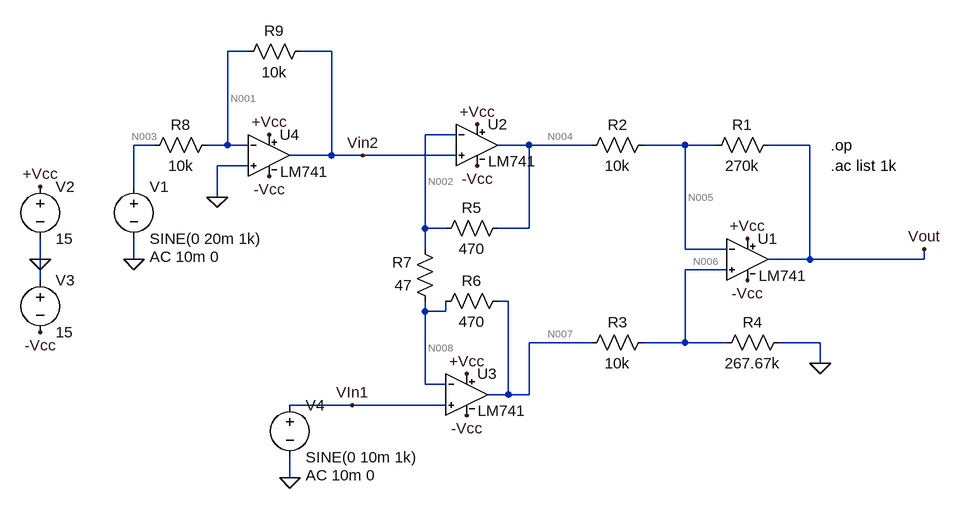
[diagram p0: schematic Expt5_Diff_mode.asc]
Expt5_Diff_mode.asc, the LTspice schematic file:
Version 4
SHEET 1 912 680
WIRE -160 -240 -192 -240
WIRE -32 -240 -80 -240
WIRE 160 -112 112 -112
WIRE -304 -96 -336 -96
WIRE -192 -96 -192 -240
WIRE -192 -96 -224 -96
WIRE -160 -96 -192 -96
WIRE 272 -96 224 -96
WIRE 368 -96 272 -96
WIRE 512 -96 448 -96
WIRE 560 -96 512 -96
WIRE 704 -96 640 -96
WIRE -32 -80 -32 -240
WIRE -32 -80 -96 -80
WIRE 16 -80 -32 -80
WIRE 160 -80 16 -80
WIRE -160 -64 -208 -64
WIRE -336 -32 -336 -96
WIRE -208 -16 -208 -64
WIRE 112 32 112 -112
WIRE 144 32 112 32
WIRE 272 32 272 -96
WIRE 272 32 224 32
WIRE 112 64 112 32
WIRE 512 64 512 -96
WIRE 576 64 512 64
WIRE -480 80 -480 48
WIRE -336 80 -336 48
WIRE 704 80 704 -96
WIRE 704 80 640 80
WIRE 880 80 880 64
WIRE 880 80 704 80
WIRE 576 96 512 96
WIRE -480 112 -480 80
WIRE 240 144 224 144
WIRE 112 160 112 144
WIRE 144 160 144 144
WIRE 144 160 112 160
WIRE 368 208 272 208
WIRE 512 208 512 96
WIRE 512 208 448 208
WIRE 576 208 512 208
WIRE 720 208 656 208
WIRE 720 240 720 208
WIRE 112 272 112 160
WIRE 144 272 112 272
WIRE 240 288 240 144
WIRE 240 288 208 288
WIRE 272 288 272 208
WIRE 272 288 240 288
WIRE 0 304 -96 304
WIRE 144 304 0 304
WIRE -96 416 -96 384
FLAG 720 240 0
FLAG -480 80 0
FLAG -480 -32 +Vcc
FLAG 608 48 +Vcc
FLAG -480 192 -Vcc
FLAG 608 112 -Vcc
FLAG 880 64 Vout
FLAG 176 256 +Vcc
FLAG 192 -128 +Vcc
FLAG 192 -64 -Vcc
FLAG 176 320 -Vcc
FLAG -336 80 0
FLAG -208 -16 0
FLAG -128 -112 +Vcc
FLAG -128 -48 -Vcc
FLAG -96 416 0
FLAG 0 304 VIn1
FLAG 16 -80 Vin2
SYMBOL LM741 608 16 R0
SYMATTR InstName U1
SYMBOL res 656 -112 R90
WINDOW 0 0 56 VBottom 2
WINDOW 3 32 56 VTop 2
SYMATTR InstName R1
SYMATTR Value 270k
SYMBOL res 464 -112 R90
WINDOW 0 0 56 VBottom 2
WINDOW 3 32 56 VTop 2
SYMATTR InstName R2
SYMATTR Value 10k
SYMBOL res 464 192 R90
WINDOW 0 0 56 VBottom 2
WINDOW 3 32 56 VTop 2
SYMATTR InstName R3
SYMATTR Value 10k
SYMBOL res 672 192 R90
WINDOW 0 0 56 VBottom 2
WINDOW 3 32 56 VTop 2
SYMATTR InstName R4
SYMATTR Value 267.67k
SYMBOL voltage -336 -48 R0
WINDOW 123 24 124 Left 2
WINDOW 39 0 0 Left 2
SYMATTR Value2 AC 10m 0
SYMATTR InstName V1
SYMATTR Value SINE(0 20m 1k)
SYMBOL voltage -480 -48 R0
WINDOW 123 0 0 Left 2
WINDOW 39 0 0 Left 2
SYMATTR InstName V2
SYMATTR Value 15
SYMBOL voltage -480 96 R0
WINDOW 123 0 0 Left 2
WINDOW 39 0 0 Left 2
SYMATTR InstName V3
SYMATTR Value 15
SYMBOL LM741 192 -160 R0
SYMATTR InstName U2
SYMBOL LM741 176 224 R0
SYMATTR InstName U3
SYMBOL res 240 16 R90
WINDOW 0 0 56 VBottom 2
WINDOW 3 32 56 VTop 2
SYMATTR InstName R5
SYMATTR Value 470
SYMBOL res 240 128 R90
WINDOW 0 0 56 VBottom 2
WINDOW 3 32 56 VTop 2
SYMATTR InstName R6
SYMATTR Value 470
SYMBOL res 128 160 R180
WINDOW 0 36 76 Left 2
WINDOW 3 36 40 Left 2
SYMATTR InstName R7
SYMATTR Value 47
SYMBOL LM741 -128 -144 R0
SYMATTR InstName U4
SYMBOL res -208 -112 R90
WINDOW 0 0 56 VBottom 2
WINDOW 3 32 56 VTop 2
SYMATTR InstName R8
SYMATTR Value 10k
SYMBOL res -64 -256 R90
WINDOW 0 0 56 VBottom 2
WINDOW 3 32 56 VTop 2
SYMATTR InstName R9
SYMATTR Value 10k
SYMBOL voltage -96 288 R0
WINDOW 123 24 124 Left 2
WINDOW 39 0 0 Left 2
SYMATTR Value2 AC 10m 0
SYMATTR InstName V4
SYMATTR Value SINE(0 10m 1k)
TEXT 736 -96 Left 2 !.op
TEXT 736 -64 Left 2 !.ac list 1k

The netlist it stands for:
* Expt5_Diff_mode.asc
XU1 N006 N005 +Vcc -Vcc Vout LM741  ; pins In+ In- V+ V- OUT
R1 Vout N005 270k
R2 N005 N004 10k
R3 N006 N007 10k
R4 0 N006 267.67k
V1 N003 0 SINE(0 20m 1k) AC 10m 0
V2 +Vcc 0 15
V3 0 -Vcc 15
XU2 Vin2 N002 +Vcc -Vcc N004 LM741  ; pins In+ In- V+ V- OUT
XU3 VIn1 N008 +Vcc -Vcc N007 LM741  ; pins In+ In- V+ V- OUT
R5 N004 N002 470
R6 N007 N008 470
R7 N008 N002 47
XU4 0 N001 +Vcc -Vcc Vin2 LM741  ; pins In+ In- V+ V- OUT
R8 N001 N003 10k
R9 Vin2 N001 10k
V4 VIn1 0 SINE(0 10m 1k) AC 10m 0
.op
.ac list 1k
.lib LM741.lib
.backanno
.end

* Results of the author's LTspice run, read from the files saved beside the schematic
* Operating Point, zero values left out:
*   V(n005) = -27.64 mV
*   V(n006) = -28.64 mV
*   V(-vcc) = -15 V
*   V(+vcc) = 15 V
*   V(vout) = -1.671 V
*   V(n004) = 34.25 mV
*   V(n007) = -29.13 mV
*   V(n002) = 4.018 mV
*   V(vin2) = 3.019 mV
*   V(n008) = 1 mV
*   V(n001) = 1 mV
*   I(R9) = 201.9 nA
*   I(R8) = 100 nA
*   I(R7) = -64.22 µA
*   I(R6) = -64.12 µA
*   I(R5) = 64.32 µA
*   I(R4) = 107 nA
*   I(R3) = 49.18 nA
*   I(R2) = -6.188 µA
*   I(R1) = -6.086 µA
*   I(V4) = -57.86 nA
*   I(V3) = -6.818 mA
*   I(V2) = -6.818 mA
*   I(V1) = 100 nA
* AC Analysis:
*   frequency = 1 k
*   V(n005) = 201.5 mV
*   V(n006) = 202.2 mV
*   V(-vcc) = 0 V
*   V(+vcc) = 0 V
*   V(vout) = 11.31 V
*   V(n004) = -209.8 mV
*   V(n007) = 209.8 mV
*   V(n003) = 10 mV
*   V(n002) = -9.99 mV
*   V(vin2) = -10 mV
*   V(n008) = 9.991 mV
*   V(vin1) = 10 mV
*   V(n001) = 66.74 nV
*   I(R9) = -1 µA
*   I(R8) = -1 µA
*   I(R7) = 425.1 µA
*   I(R6) = 425.1 µA
*   I(R5) = -425.1 µA
*   I(R4) = -755.5 nA
*   I(R3) = -758 nA
*   I(R2) = 41.13 µA
*   I(R1) = 41.13 µA
*   I(V4) = -33.44 pA
*   I(V3) = 170.7 µA
*   I(V2) = 171 µA
*   I(V1) = -1 µA
* From the log:
*   Semiconductor Device Operating Points:
*                           --- Diodes ---
*   Name:    d:u4:3      d:u4:4      d:u4:6      d:u4:5      d:u4:2
*   Model:    u4:dx       u4:dx       u4:dx       u4:dx       u4:dx
*   Id:     -1.81e-13   -1.81e-13    7.63e-05    7.61e-05   -1.34e-11
*   Vd:     -1.80e-01   -1.80e-01    6.48e-01    6.48e-01   -1.34e+01
*   Req:     1.00e+12    1.00e+12    3.39e+02    3.40e+02    1.00e+12
*   CAP:     0.00e+00    0.00e+00    0.00e+00    0.00e+00    0.00e+00
*   Name:    d:u4:1      d:u3:3      d:u3:4      d:u3:6      d:u3:5
*   Model:    u4:dx       u3:dx       u3:dx       u3:dx       u3:dx
*   Id:     -1.34e-11   -1.92e-13   -1.70e-13    5.02e-05    1.14e-04
*   Vd:     -1.34e+01   -1.91e-01   -1.69e-01    6.37e-01    6.59e-01
*   Req:     1.00e+12    1.00e+12    1.00e+12    5.15e+02    2.26e+02
*   CAP:     0.00e+00    0.00e+00    0.00e+00    0.00e+00    0.00e+00
*   Name:    d:u3:2      d:u3:1      d:u2:3      d:u2:4      d:u2:6
*   Model:    u3:dx       u3:dx       u2:dx       u2:dx       u2:dx
*   Id:     -1.33e-11   -1.34e-11   -1.68e-13   -1.94e-13    1.19e-04
*   Vd:     -1.33e+01   -1.34e+01   -1.67e-01   -1.93e-01    6.60e-01
*   Req:     1.00e+12    1.00e+12    1.00e+12    1.00e+12    2.18e+02
*   CAP:     0.00e+00    0.00e+00    0.00e+00    0.00e+00    0.00e+00
*   Name:    d:u2:5      d:u2:2      d:u2:1      d:u1:3      d:u1:4
*   Model:    u2:dx       u2:dx       u2:dx       u1:dx       u1:dx
*   Id:      4.82e-05   -1.34e-11   -1.33e-11   -1.82e-13   -1.80e-13
*   Vd:      6.36e-01   -1.34e+01   -1.33e+01   -1.81e-01   -1.79e-01
*   Req:     5.36e+02    1.00e+12    1.00e+12    1.00e+12    1.00e+12
*   CAP:     0.00e+00    0.00e+00    0.00e+00    0.00e+00    0.00e+00
*   Name:    d:u1:6      d:u1:5      d:u1:2      d:u1:1
*   Model:    u1:dx       u1:dx       u1:dx       u1:dx
*   Id:      7.32e-05    7.93e-05   -1.17e-11   -1.50e-11
*   Vd:      6.47e-01    6.49e-01   -1.17e+01   -1.50e+01
*   Req:     3.53e+02    3.26e+02    1.00e+12    1.00e+12
*   CAP:     0.00e+00    0.00e+00    0.00e+00    0.00e+00
*                           --- Bipolar Transistors ---
*   Name:     q:u4:2      q:u4:1      q:u3:2      q:u3:1      q:u2:2
*   Model:     u4:qx       u4:qx       u3:qx       u3:qx       u2:qx
*   Ib:       7.99e-08    7.99e-08    7.99e-08    7.99e-08    7.99e-08
*   Ic:       4.99e-05    4.99e-05    4.99e-05    4.99e-05    4.99e-05
*   Vbe:      6.97e-01    6.97e-01    6.97e-01    6.97e-01    6.97e-01
*   Vbc:     -1.50e+01   -1.50e+01   -1.50e+01   -1.50e+01   -1.50e+01
*   Vce:      1.57e+01    1.57e+01    1.57e+01    1.57e+01    1.57e+01
*   BetaDC:   6.25e+02    6.25e+02    6.25e+02    6.25e+02    6.25e+02
*   Gm:       1.93e-03    1.93e-03    1.93e-03    1.93e-03    1.93e-03
*   Rpi:      3.24e+05    3.24e+05    3.24e+05    3.24e+05    3.24e+05
*   Rx:       0.00e+00    0.00e+00    0.00e+00    0.00e+00    0.00e+00
*   Ro:       0.00e+00    0.00e+00    0.00e+00    0.00e+00    0.00e+00
*   Cbe:      0.00e+00    0.00e+00    0.00e+00    0.00e+00    0.00e+00
*   Cbc:      0.00e+00    0.00e+00    0.00e+00    0.00e+00    0.00e+00
*   Cjs:      0.00e+00    0.00e+00    0.00e+00    0.00e+00    0.00e+00
*   BetaAC:   6.25e+02    6.25e+02    6.25e+02    6.25e+02    6.25e+02
*   Cbx:      0.00e+00    0.00e+00    0.00e+00    0.00e+00    0.00e+00
*   Ft:       0.00e+00    0.00e+00    0.00e+00    0.00e+00    0.00e+00
*   Name:     q:u2:1      q:u1:2      q:u1:1
*   Model:     u2:qx       u1:qx       u1:qx
*   Ib:       7.99e-08    7.98e-08    7.99e-08
*   Ic:       4.99e-05    4.99e-05    4.99e-05
*   Vbe:      6.97e-01    6.97e-01    6.97e-01
*   Vbc:     -1.50e+01   -1.50e+01   -1.50e+01
*   Vce:      1.57e+01    1.57e+01    1.57e+01
*   BetaDC:   6.25e+02    6.25e+02    6.25e+02
*   Gm:       1.93e-03    1.93e-03    1.93e-03
*   Rpi:      3.24e+05    3.24e+05    3.24e+05
*   Rx:       0.00e+00    0.00e+00    0.00e+00
*   Ro:       0.00e+00    0.00e+00    0.00e+00
*   Cbe:      0.00e+00    0.00e+00    0.00e+00
*   Cbc:      0.00e+00    0.00e+00    0.00e+00
*   Cjs:      0.00e+00    0.00e+00    0.00e+00
*   BetaAC:   6.25e+02    6.25e+02    6.25e+02
*   Cbx:      0.00e+00    0.00e+00    0.00e+00
*   Ft:       0.00e+00    0.00e+00    0.00e+00